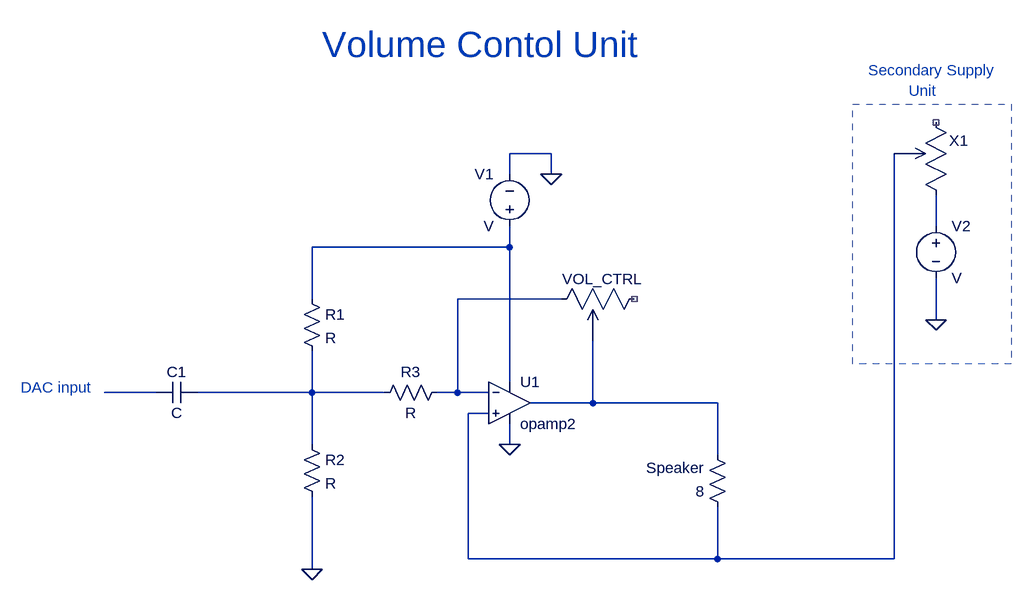
[diagram p0: schematic Volume Control Design.asc]
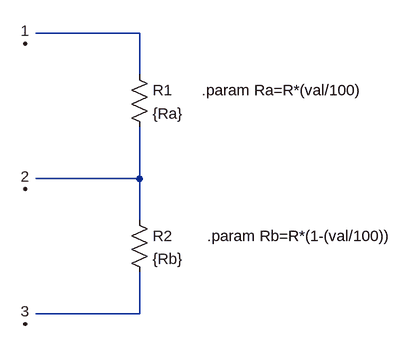
[diagram p1: sub-circuit pot.asc]
Volume Control Design.asc, the LTspice schematic file:
Version 4
SHEET 1 1144 680
WIRE 432 -144 368 -144
WIRE 368 -112 368 -144
WIRE 432 -112 432 -144
WIRE 1024 -32 1024 -80
WIRE 368 0 368 -32
WIRE 368 0 64 0
WIRE 64 80 64 0
WIRE 448 80 288 80
WIRE 1024 112 1024 48
WIRE 368 208 368 0
WIRE -176 224 -256 224
WIRE 64 224 64 160
WIRE 64 224 -112 224
WIRE 176 224 64 224
WIRE 288 224 288 80
WIRE 288 224 256 224
WIRE 336 224 288 224
WIRE 496 240 496 144
WIRE 496 240 400 240
WIRE 688 240 496 240
WIRE 336 256 304 256
WIRE 64 304 64 224
WIRE 368 304 368 272
WIRE 688 320 688 240
WIRE 304 480 304 256
WIRE 688 480 688 400
WIRE 688 480 304 480
WIRE 960 480 960 -144
WIRE 960 480 688 480
WIRE 64 496 64 384
FLAG 64 496 0
FLAG 368 304 0
FLAG 432 -112 0
FLAG 1024 112 0
SYMBOL Opamps/opamp2 368 176 R0
SYMATTR InstName U1
SYMBOL res 48 64 R0
SYMATTR InstName R1
SYMBOL res 48 288 R0
SYMATTR InstName R2
SYMBOL cap -112 208 R90
WINDOW 0 0 32 VBottom 2
WINDOW 3 32 32 VTop 2
SYMATTR InstName C1
SYMBOL res 272 208 R90
WINDOW 0 0 56 VBottom 2
WINDOW 3 32 56 VTop 2
SYMATTR InstName R3
SYMBOL res 704 416 R180
WINDOW 0 36 76 Left 2
WINDOW 3 36 40 Left 2
SYMATTR InstName Speaker
SYMATTR Value 8
SYMBOL voltage 368 -16 R180
WINDOW 0 24 96 Left 2
WINDOW 3 24 16 Left 2
SYMATTR InstName V1
SYMBOL pot 464 96 R270
WINDOW 0 47 -15 VRight 2
SYMATTR InstName VOL_CTRL
SYMBOL pot 1008 -176 R0
SYMATTR InstName X1
SYMBOL voltage 1024 -48 R0
SYMATTR InstName V2
TEXT 920 -272 Left 2 ;Secondary Supply  \n         Unit
TEXT -384 216 Left 2 ;DAC input
TEXT 80 -312 Left 5 ;Volume Contol Unit
RECTANGLE Normal 896 -220 1140 180 2

pot.asc, the sub-circuit schematic file:
Version 4
SHEET 1 880 680
WIRE 416 64 256 64
WIRE 416 128 416 64
WIRE 416 288 416 208
WIRE 416 288 256 288
WIRE 416 352 416 288
WIRE 416 496 416 432
WIRE 416 496 256 496
FLAG 240 80 1
FLAG 240 304 2
FLAG 240 512 3
SYMBOL res 400 112 R0
SYMATTR InstName R1
SYMATTR Value {Ra}
SYMBOL res 400 336 R0
SYMATTR InstName R2
SYMATTR Value {Rb}
TEXT 512 152 Left 2 !.param Ra=R*(val/100)
TEXT 520 376 Left 2 !.param Rb=R*(1-(val/100))

The netlist it stands for:
* Volume Control Design.asc
XU1 N007 N003 N002 0 N006 opamp2  ; pins In+ In- V+ V- OUT
R1 N002 N005 R
R2 N005 0 R
C1 N005 N004 C
R3 N003 N005 R
R§Speaker N007 N006 8
V1 N002 0 V
XVOL_CTRL N003 N006 NC_01 pot
XX1 NC_02 N007 N001 pot
V2 N001 0 V

* block symbol definitions
.subckt pot 1 2 3
R1 N001 N002 {Ra}
R2 N002 N003 {Rb}
.param Ra=R*(val/100)
.param Rb=R*(1-(val/100))
.ends pot

* Secondary Supply
*          Unit
* DAC input
* Volume Contol Unit
.backanno
.end